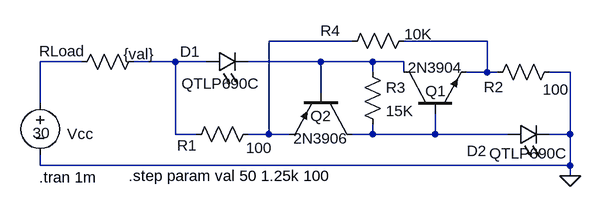
[diagram p0: schematic 2q&2LedConstCorr.asc]
2q&2LedConstCorr.asc, the LTspice schematic file:
Version 4
SHEET 1 880 680
WIRE -160 160 -160 96
WIRE -160 256 -160 240
WIRE -96 96 -160 96
WIRE 48 96 -16 96
WIRE 48 208 48 96
WIRE 80 208 48 208
WIRE 96 96 48 96
WIRE 192 208 160 208
WIRE 192 208 192 64
WIRE 224 208 192 208
WIRE 272 96 160 96
WIRE 272 144 272 96
WIRE 320 64 192 64
WIRE 352 96 272 96
WIRE 352 112 352 96
WIRE 352 208 320 208
WIRE 352 208 352 192
WIRE 400 96 352 96
WIRE 400 112 400 96
WIRE 448 208 352 208
WIRE 448 208 448 176
WIRE 528 64 400 64
WIRE 528 112 496 112
WIRE 528 112 528 64
WIRE 544 112 528 112
WIRE 560 208 448 208
WIRE 656 112 624 112
WIRE 656 208 624 208
WIRE 656 208 656 112
WIRE 656 256 -160 256
WIRE 656 256 656 208
WIRE 656 272 656 256
FLAG 656 272 0
SYMBOL LED 560 224 R270
WINDOW 0 -25 -48 VTop 0
WINDOW 3 2 32 VBottom 0
SYMATTR InstName D2
SYMATTR Value QTLP690C
SYMBOL npn2 400 176 R270
WINDOW 0 35 33 VRight 0
WINDOW 3 71 6 VRight 0
SYMATTR InstName Q1
SYMATTR Value 2N3904
SYMBOL pnp2 320 144 R90
WINDOW 0 36 32 VRight 0
WINDOW 3 70 5 VRight 0
SYMATTR InstName Q2
SYMATTR Value 2N3906
SYMBOL res 64 224 R270
WINDOW 0 -17 2 VTop 0
WINDOW 3 11 113 VBottom 0
SYMATTR InstName R1
SYMATTR Value 100
SYMBOL LED 96 112 R270
WINDOW 0 16 -25 VTop 0
WINDOW 3 -2 22 VBottom 0
SYMATTR InstName D1
SYMATTR Value QTLP690C
SYMBOL res 528 128 R270
WINDOW 0 -23 10 VTop 0
WINDOW 3 5 106 VBottom 0
SYMATTR InstName R2
SYMATTR Value 100
SYMBOL res 336 96 R0
SYMATTR InstName R3
SYMATTR Value 15K
SYMBOL res 304 80 R270
WINDOW 0 16 -17 VTop 0
WINDOW 3 42 118 VBottom 0
SYMATTR InstName R4
SYMATTR Value 10K
SYMBOL voltage -160 144 R0
WINDOW 0 81 63 Right 0
WINDOW 3 -12 62 Left 0
WINDOW 123 0 0 Left 0
WINDOW 39 0 0 Left 0
SYMATTR InstName Vcc
SYMATTR Value 30
SYMBOL res 0 80 R90
WINDOW 0 15 126 VBottom 0
WINDOW 3 -11 8 VTop 0
SYMATTR InstName RLoad
SYMATTR Value {val}
TEXT -162 274 Left 0 !.tran 1m
TEXT -24 272 Left 0 !.step param val 50 1.25k 100

The netlist it stands for:
* 2q&2LedConstCorr.asc
D2 N005 0 QTLP690C
Q1 N004 N005 N006 0 2N3904
Q2 N005 N004 N003 0 2N3906
R1 N002 N003 100
D1 N002 N004 QTLP690C
R2 N006 0 100
R3 N004 N005 15K
R4 N003 N006 10K
Vcc N001 0 30
RLoad N002 N001 {val}
.model D D
.lib standard.dio
.model NPN NPN
.model PNP PNP
.lib standard.bjt
.tran 1m
.step param val 50 1.25k 100
.backanno
.end